# Altium schematic sheet buffer.SchDoc: ADC BUFFER
size A4; Organization: Altium Limited; Address1: L3, 12a Rodborough Rd; Address2: Frenchs Forest; Address3: NSW; Address4: Australia 2086; DocumentNumber: 1; Revision: 1
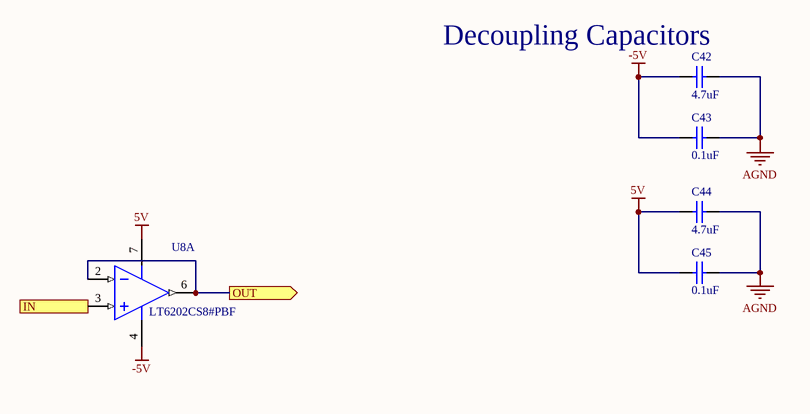
[diagram p0: buffer.SchDoc]

## Parts
C42  4.7uF  [0402_Cap]
C43  0.1uF  [0402_Cap]
C44  4.7uF  [0402_Cap]
C45  0.1uF  [0402_Cap]
U8  LT6202CS8#PBF  [LT-S8-8_N]  (part A of 2)

## Ports
IN (in), OUT (out)

## Nets
5V: C44.1 C45.1 U8.7(V+)
-5V: C42.1 C43.1 U8.4(V-)
AGND: C42.2 C43.2 C44.2 C45.2
IN: U8.3(+IN) ; port IN
OUT: U8.2(-IN) U8.6(OUT) ; port OUT

## Notes on the sheet
- (near C42) Decoupling Capacitors
- Title
- Date:
- RE:
- Arturo di Girolamo
- Size:
- A3
- A

## Library data of the parts
C42 C44 = CL21A475KAQNNNE: Capacitor, 4.7uF, 0805; Value: .01uf; ASYPN: GRM155R61A475MEAAD; MFGPN: CL21A475KAQNNNE
C43 C45 = CL21B104KACNNNC: Capacitor, 0.1uF, 0805; Value: .01uf; ASYPN: 0402YC104KAT2A; MFGPN: CL21B104KACNNNC
U8 = CMP-0359-02644-2: Single Channel, Low Noise, High Speed Operational Amplifier, RRIO, 100 MHz Typical GBW, 25 V/us Typical SR, 2.5 to 12.6 V, 8-Pin SOIC (S8-8), Commercial, Pb-Free; Linear Technology Part Number: LT6202; Manufacturer: Linear Technology; Channels (#): 1; Vs Min (V): 2.5; Is (mA) Typical: 2.8; Vos (mV) Typical: 0.1; Vos (mV) Guaranteed: 0.5; GBW (MHz) Typical: 100; Vs Max (V): 12.6; SR (V/us) Typical: 25; RevisionNote: URLs updated; ComponentLink2URL: http://cds.linear.com/docs/en/datasheet/620234fd.pdf; PackageDescription: 8-Pin Plastic Small Outline, Body 4.9 x 3.9 mm, Pitch 1.27 mm; RoHS: Pb-Free; ComponentLink3Description: Package Specification; ComponentLink2Description: Datasheet; PackageVersion: Rev G; ComponentLink3URL: http://cds.linear.com/docs/en/packaging/05081610_G_SO8.pdf; ComponentLink1Description: Manufacturer URL; DatasheetVersion: Rev. D; PackageReference: LT-S8-8; Mounting Technology: Surface Mount; ComponentLink1URL: http://www.linear.com/; Type: VFB; PartNumber: LT6202CS8#PBF; ASYPN: LT6202CS8#PBF